# EAGLE board STM32-PROX (EAGLE 6.5.0), part 1 of 2
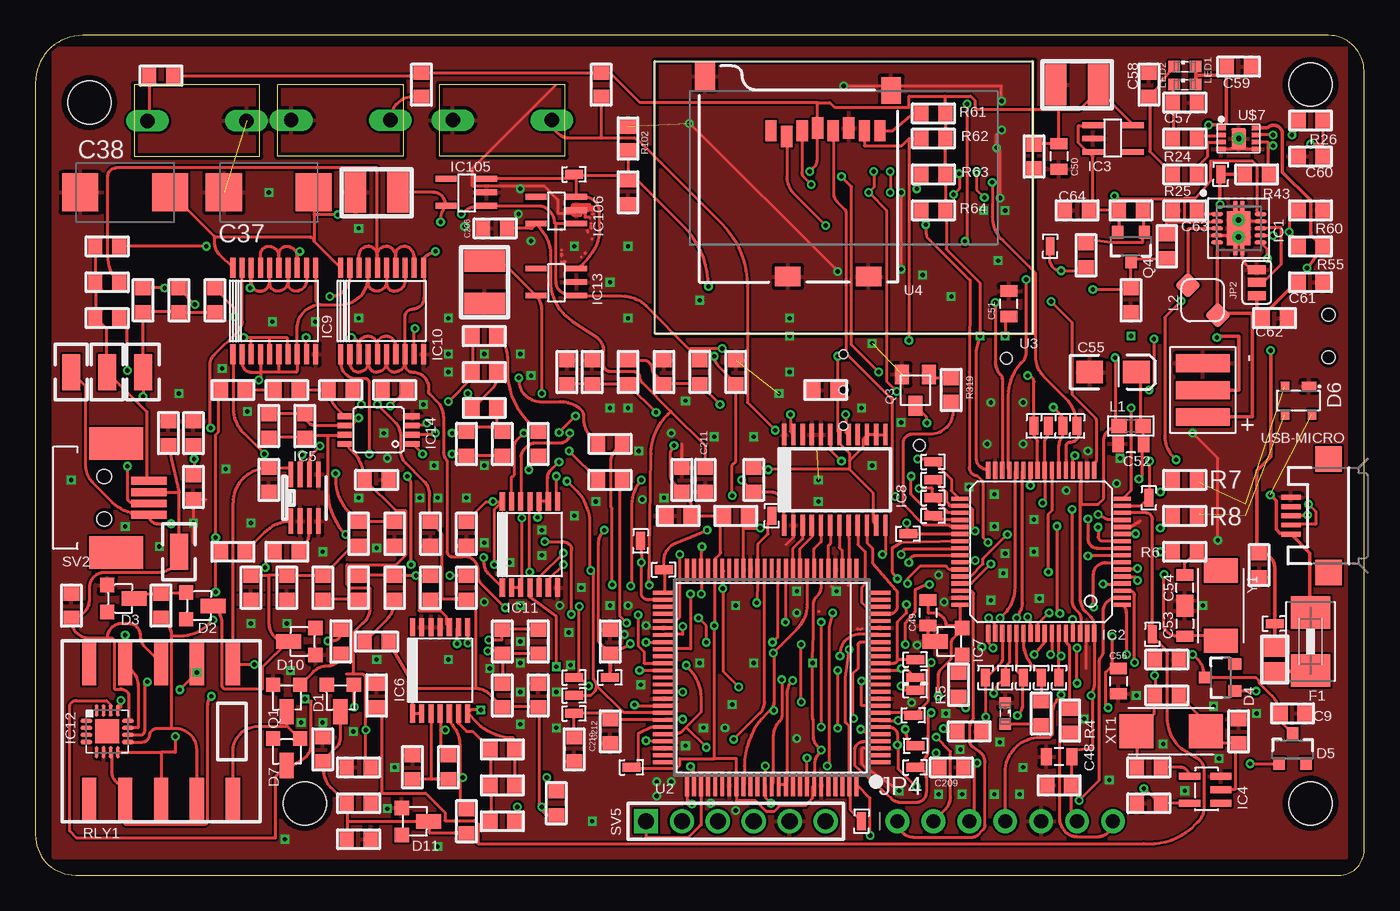
[diagram p8: board, top side]
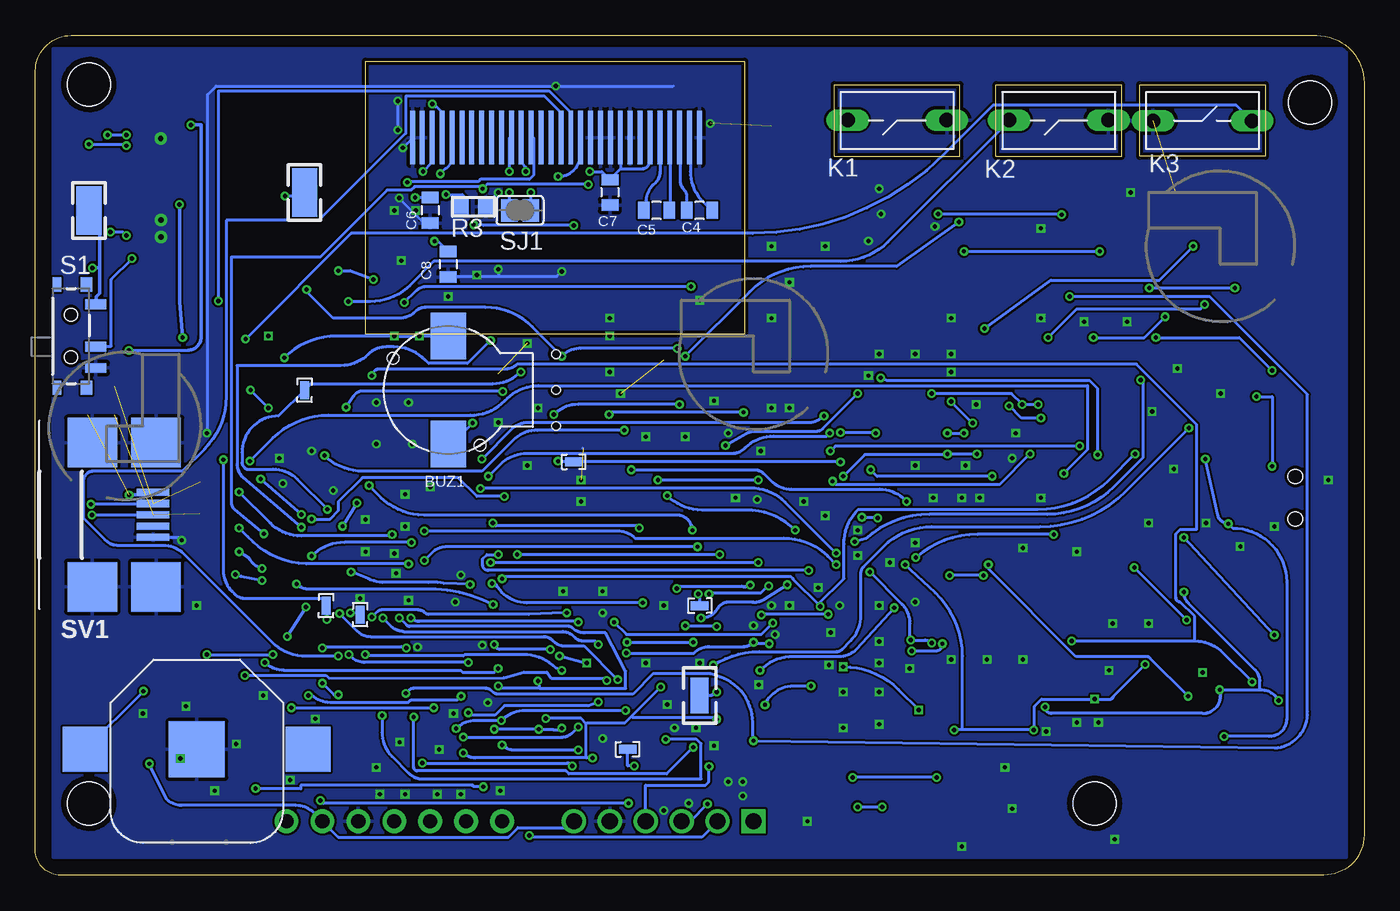
[diagram p9: board, bottom side, seen from below]

Size 93.96 x 59.36 mm. Coordinates in mm from the lower left corner, seen from the top.
Outline: 0,55.99 0,2.84 arc90 2.84,0 92.18,0 arc90 93.96,1.78 93.96,56.82 arc90 91.42,59.36 3.37,59.36 arc90 0,55.99
Outline: 6.98,55.88 6.98,50.8 15.88,50.8 15.88,55.88 6.98,55.88
Outline: 17.14,50.8 17.14,55.88 26.03,55.88 26.03,50.8 17.14,50.8
Outline: 37.46,55.88 28.58,55.88 28.58,50.8 37.46,50.8 37.46,55.88
Outline: 70.61,57.53 43.82,57.53 43.82,38.23 70.61,38.23 70.61,57.53
Copper layers (1*16): Top 0.035mm / dielectric 1.5mm / Bottom 0.035mm
Design rules "ITEADstudio_DRC *": minimum track width 6mil, minimum drill 12mil, track to track 6mil, track to pad 6mil, pad to pad 6mil, via to via 6mil, smd to smd 0mil, copper to edge 10mil, drill to drill 10mil, minimum pad ring 10mil, minimum via ring 6mil, stop-mask expansion 2mil, vias tented up to drill 100mil, thermal gap 10mil
Net classes: 0 default: width 0.203 mm; 1 adc: width 0.203 mm; 2 power: width 0.254 mm, drill 0.254 mm, clearance 0.203 mm
Holes 0.6 mm at 57.15,36.83 57.15,34.29 57.15,31.75

## Footprints (pad centres in the part's own frame; a part is rotated, then mirrored left to right if it is on the bottom)
NSL_SPARKFUN_BATTCON_12MM = smd 3.962 x 3.962: GND 0,0 | smd 3.175 x 3.175: PWR@1 -7.874,0; PWR@2 7.874,0
BUZZER = smd 3.3 x 2.5: 1 3.81,0; 2 -3.81,0 | hole 0.8: -3.897,-2.25; 2.25,3.897
RLC_0603 = smd 1 x 1.1: 1 -0.85,0; 2 0.85,0
0805 = smd 0.8 x 1.2: 1 -0.9,0; 2 0.9,0
RLC_1210 = smd 1.5 x 2.9: 1 -1.5,0; 2 1.5,0
D/7343-31R = smd 2.55 x 2.7: + 3.175,0; - -3.175,0
EIA3216-KIT = smd 1.9 x 1.6: A 1.65,0; C -1.65,0
SOT23-3LEAD = smd 1.016 x 1.016: 1 -0.94,-0.762; 2 0.965,-0.762 | smd 1.016 x 1.778: 3 0.013,1.143
SOT23-3 = smd 0.8 x 0.9: 1 -0.95,-1; 2 0.95,-1; 3 0,1.1
USBUG_SOT143B = smd 1 x 0.7: 1 -0.75,-1 | smd 0.6 x 0.7: 2 0.95,-1; 3 0.95,1; 4 -0.95,1
1812 = smd 2.286 x 2.794: 1 -2.046,0; 2 2.046,0
QFN-10 = smd 0.28 x 0.85: 1 -1,-1.545; 2 -0.5,-1.545; 3 0,-1.545; 4 0.5,-1.545; 5 1,-1.545; 6 1,1.545; 7 0.5,1.545; 8 0,1.545; 9 -0.5,1.545; 10 -1,1.545 | smd 2.4 x 1.65: P0 0,0 | smd 0.7 x 0.28: P1 -1.55,-0.25; P2 1.55,-0.25; P3 1.55,0.25; P4 -1.55,0.25 | drill 0.381: V0 -0.6,0; V1 0.6,0
LQFP64A_PACKAGE = smd 1.2 x 0.3: 1 -5.75,3.75; 2 -5.75,3.25; 3 -5.75,2.75; 4 -5.75,2.25; 5 -5.75,1.75; 6 -5.75,1.25; 7 -5.75,0.75; 8 -5.75,0.25; 9 -5.75,-0.25; 10 -5.75,-0.75; 11 -5.75,-1.25; 12 -5.75,-1.75; 13 -5.75,-2.25; 14 -5.75,-2.75; 15 -5.75,-3.25; 16 -5.75,-3.75; 33 5.75,-3.75; 34 5.75,-3.25; 35 5.75,-2.75; 36 5.75,-2.25; 37 5.75,-1.75; 38 5.75,-1.25; 39 5.75,-0.75; 40 5.75,-0.25; 41 5.75,0.25; 42 5.75,0.75; 43 5.75,1.25; 44 5.75,1.75; 45 5.75,2.25; 46 5.75,2.75; 47 5.75,3.25; 48 5.75,3.75 | smd 0.3 x 1.2: 17 -3.75,-5.75; 18 -3.25,-5.75; 19 -2.75,-5.75; 20 -2.25,-5.75; 21 -1.75,-5.75; 22 -1.25,-5.75; 23 -0.75,-5.75; 24 -0.25,-5.75; 25 0.25,-5.75; 26 0.75,-5.75; 27 1.25,-5.75; 28 1.75,-5.75; 29 2.25,-5.75; 30 2.75,-5.75; 31 3.25,-5.75; 32 3.75,-5.75; 49 3.75,5.75; 50 3.25,5.75; 51 2.75,5.75; 52 2.25,5.75; 53 1.75,5.75; 54 1.25,5.75; 55 0.75,5.75; 56 0.25,5.75; 57 -0.25,5.75; 58 -0.75,5.75; 59 -1.25,5.75; 60 -1.75,5.75; 61 -2.25,5.75; 62 -2.75,5.75; 63 -3.25,5.75; 64 -3.75,5.75
SOT-23-5 = smd 0.4 x 1.5: 1 -0.94,-1.422; 2 0.01,-1.422; 3 0.96,-1.422; 4 0.96,1.428; 5 -0.94,1.428
SMV-5 = smd 1.5 x 0.5: 1 0,0; 2 0,-0.95; 3 0,-1.9; 4 2.2,-1.9; 5 2.2,0
SOT-23-8-OR-MSOP-8 = smd 0.325 x 1.8: 1 -0.975,-1.65; 2 -0.325,-1.65; 3 0.325,-1.65; 4 0.975,-1.65; 5 0.975,1.65; 6 0.325,1.65; 7 -0.325,1.65; 8 -0.975,1.65
TSSOP-14 = smd 1.3 x 0.36: 1 0,0; 2 0,-0.65; 3 0,-1.3; 4 0,-1.95; 5 0,-2.6; 6 0,-3.25; 7 0,-3.9; 8 6.095,-3.9; 9 6.095,-3.25; 10 6.095,-2.6; 11 6.095,-1.95; 12 6.095,-1.3; 13 6.095,-0.65; 14 6.095,0
TSSOP-24 = smd 0.3 x 1.5: 1 -2.925,-3.2; 2 -2.275,-3.2; 3 -1.625,-3.2; 4 -0.975,-3.2; 5 -0.325,-3.2; 6 0.325,-3.2; 7 0.975,-3.2; 8 1.625,-3.2; 9 2.275,-3.2; 10 2.925,-3.2; 11 3.575,-3.2; 12 4.225,-3.2; 13 4.225,3.2; 14 3.575,3.2; 15 2.925,3.2; 16 2.275,3.2; 17 1.625,3.2; 18 0.975,3.2; 19 0.325,3.2; 20 -0.325,3.2; 21 -0.975,3.2; 22 -1.625,3.2; 23 -2.275,3.2; 24 -2.925,3.2
TSSOP-20 = smd 1.4 x 0.36: 1 0,0; 2 0,-0.65; 3 0,-1.3; 4 0,-1.95; 5 0,-2.6; 6 0,-3.25; 7 0,-3.9; 8 0,-4.55; 9 0,-5.2; 10 0,-5.85; 11 6.095,-5.85; 12 6.095,-5.2; 13 6.095,-4.55; 14 6.095,-3.9; 15 6.095,-3.25; 16 6.095,-2.6; 17 6.095,-1.95; 18 6.095,-1.3; 19 6.095,-0.65; 20 6.095,0
QFN16 = smd 0.85 x 0.3: 1 -1.475,0.75; 2 -1.475,0.25; 3 -1.475,-0.25; 4 -1.475,-0.75; 9 1.475,-0.75; 10 1.475,-0.25; 11 1.475,0.25; 12 1.475,0.75 | smd 0.3 x 0.85: 5 -0.75,-1.475; 6 -0.25,-1.475; 7 0.25,-1.475; 8 0.75,-1.475; 13 0.75,1.475; 14 0.25,1.475; 15 -0.25,1.475; 16 -0.75,1.475 | smd 1.7 x 1.7: TH 0,0
MSOP8 = smd 0.41 x 1.02: 1 0,0; 2 0.65,0; 3 1.3,0; 4 1.95,0; 5 1.95,4.8; 6 1.3,4.8; 7 0.65,4.8; 8 0,4.8
SJ_3 = smd 0.635 x 1.27: 1 -0.889,0; 2 0,0; 3 0.965,0
1X07_ROUND = drill 1 pad 1.676: 1 -7.62,0; 2 -5.08,0; 3 -2.54,0; 4 0,0; 5 2.54,0; 6 5.08,0; 7 7.62,0
B3F-5XX = drill 1.016 long: 1 -3.501,-0.029; 2 3.501,-0.029
0603 = smd 1.1 x 1: 1 -0.85,0; 2 0.85,0
CDRH2D18 = smd 1.3 x 1.3 rotated 225: P$1 -1.061,1.061 | smd 1.3 x 1.3 rotated 315: P$2 1.061,-1.061
LED_SML0603 = smd 0.8 x 0.8: A 0.75,0; C -0.75,0
SOT-23-3 = smd 1 x 1.4: 1 -0.95,-1.1; 2 0.95,-1.1; 3 0,1.1
TQ-SMD-RELAY = smd 1 x 3: 1 -5.08,-4.78; 2 -2.54,-4.78; 3 0,-4.78; 4 2.54,-4.78; 5 5.08,-4.78; 6 5.08,4.78; 7 2.54,4.78; 8 0,4.78; 9 -2.54,4.78; 10 -5.08,4.78
SWITCH-SPST-SMD-A = smd 0.7 x 1.5: 1 -2.25,-1.75; 2 -0.75,-1.75; 3 2.25,-1.75 | smd 1 x 0.6: GND1 -3.65,1; GND3 3.65,1 | smd 1 x 0.8: GND2 -3.65,-1.1; GND4 3.65,-1.1 | hole 0.9: -1.5,0; 1.5,0
SOLDERJUMPER_REFLOW = smd 1.168 x 1.6: 1 -0.762,0; 2 0.762,0
USB-MINIB-SMD = smd 2.3 x 0.5: 1 2,0.4; 2 2,-0.4; 3 2,-1.2; 4 2,-2; 5 2,-2.8 | smd 3.5 x 3.5: TAB0 -2.3,3.9; TAB1 2.2,3.9; TAB2 2.2,-6.3; TAB3 -2.3,-6.3
HIROSE-MQ172-4POS = smd 0.55 x 2.5: 1 -1.2,6.75; 2 -0.4,6.75; 3 0.4,6.75; 4 1.2,6.75 | smd 2.3 x 3.8: P$1 -3.85,4.45; P$2 3.85,4.45 | hole 1: -1.5,3.6; 1.5,3.6
HEADER-MALE-6X1-0.100-UNKEYED = drill 1.143 square: 1 0,6.35 | drill 1.143: 2 0,3.81; 3 0,1.27; 4 0,-1.27; 5 0,-3.81; 6 0,-6.35
SMD-TESTPOINT = smd 1.27 x 0.635: 1 0,0
KEYSTONE-SMD-TESTPOINT-5015 = smd 2.54 x 1.27: 1 0,0
--MERGED_KEYSTONE-SMD-TESTPOINT-5015 = smd 3.429 x 1.778: 1 0,0
RLC_0805 = smd 1.3 x 1.5: 1 -0.85,0; 2 0.85,0
VQ100 = smd 0.27 x 1.6: 1 -6,-7.6; 2 -5.5,-7.6; 3 -5,-7.6; 4 -4.5,-7.6; 5 -4,-7.6; 6 -3.5,-7.6; 7 -3,-7.6; 8 -2.5,-7.6; 9 -2,-7.6; 10 -1.5,-7.6; 11 -1,-7.6; 12 -0.5,-7.6; 13 0,-7.6; 14 0.5,-7.6; 15 1,-7.6; 16 1.5,-7.6; 17 2,-7.6; 18 2.5,-7.6; 19 3,-7.6; 20 3.5,-7.6; 21 4,-7.6; 22 4.5,-7.6; 23 5,-7.6; 24 5.5,-7.6; 25 6,-7.6; 51 6,7.6; 52 5.5,7.6; 53 5,7.6; 54 4.5,7.6; 55 4,7.6; 56 3.5,7.6; 57 3,7.6; 58 2.5,7.6; 59 2,7.6; 60 1.5,7.6; 61 1,7.6; 62 0.5,7.6; 63 0,7.6; 64 -0.5,7.6; 65 -1,7.6; 66 -1.5,7.6; 67 -2,7.6; 68 -2.5,7.6; 69 -3,7.6; 70 -3.5,7.6; 71 -4,7.6; 72 -4.5,7.6; 73 -5,7.6; 74 -5.5,7.6; 75 -6,7.6 | smd 1.6 x 0.27: 26 7.6,-6; 27 7.6,-5.5; 28 7.6,-5; 29 7.6,-4.5; 30 7.6,-4; 31 7.6,-3.5; 32 7.6,-3; 33 7.6,-2.5; 34 7.6,-2; 35 7.6,-1.5; 36 7.6,-1; 37 7.6,-0.5; 38 7.6,0; 39 7.6,0.5; 40 7.6,1; 41 7.6,1.5; 42 7.6,2; 43 7.6,2.5; 44 7.6,3; 45 7.6,3.5; 46 7.6,4; 47 7.6,4.5; 48 7.6,5; 49 7.6,5.5; 50 7.6,6; 76 -7.6,6; 77 -7.6,5.5; 78 -7.6,5; 79 -7.6,4.5; 80 -7.6,4; 81 -7.6,3.5; 82 -7.6,3; 83 -7.6,2.5; 84 -7.6,2; 85 -7.6,1.5; 86 -7.6,1; 87 -7.6,0.5; 88 -7.6,0; 89 -7.6,-0.5; 90 -7.6,-1; 91 -7.6,-1.5; 92 -7.6,-2; 93 -7.6,-2.5; 94 -7.6,-3; 95 -7.6,-3.5; 96 -7.6,-4; 97 -7.6,-4.5; 98 -7.6,-5; 99 -7.6,-5.5; 100 -7.6,-6
MICROBUILDER_UG-2864HSWEG01_0.96IN_WRAPAROUND = smd 0.35 x 3.81 bottom: 1 -10.15,8.96; 2 -9.45,8.96; 3 -8.75,8.96; 4 -8.05,8.96; 5 -7.35,8.96; 6 -6.65,8.96; 7 -5.95,8.96; 8 -5.25,8.96; 9 -4.55,8.96; 10 -3.85,8.96; 11 -3.15,8.96; 12 -2.45,8.96; 13 -1.75,8.96; 14 -1.05,8.96; 15 -0.35,8.96; 16 0.35,8.96; 17 1.05,8.96; 18 1.75,8.96; 19 2.45,8.96; 20 3.15,8.96; 21 3.85,8.96; 22 4.55,8.96; 23 5.25,8.96; 24 5.95,8.96; 25 6.65,8.96; 26 7.35,8.96; 27 8.05,8.96; 28 8.75,8.96; 29 9.45,8.96; 30 10.15,8.96
MICRO-SD-SOCKET-PP = smd 0.8 x 1.5: 1 -8.94,10.7; 2 -7.84,10.3; 3 -6.74,10.7; 4 -5.64,10.9; 5 -4.54,10.7; 6 -3.44,10.9; 7 -2.34,10.7; 8 -1.24,10.7 | smd 1.8 x 1.4: CD1 -2.05,0.4; CD2 -7.75,0.4 | smd 1.4 x 1.9: GND1 -13.6,14.55; GND3 -0.45,13.55
STAND-OFF-TIGHT = hole 3.048: 0,0
UDFN-EP = smd 0.3 x 0.65: 1 -0.75,-1.25; 2 -0.25,-1.25; 3 0.25,-1.25; 4 0.75,-1.25; 5 0.75,1.25; 6 0.25,1.25; 7 -0.25,1.25; 8 -0.75,1.25 | smd 1.45 x 1.05: 9 0,0 | drill 0.356: V1 0,0
BATT = smd 1.27 x 3.81: 1 -1.905,0; 2 0,0; 3 1.905,0
USB-MICROB = smd 0.35 x 1.4: D+ 0,2.65; D- -0.65,2.65; GND 1.3,2.65; ID 0.65,2.65; VBUS -1.3,2.65 | smd 1.8 x 1.9: MT1 -4,0; MT2 4,0
XTAL-SMD-CITIZEN-CS10 = smd 2.4 x 2.4: A -0.2,0; B 4.7,0
CRYSTAL-TXC-7A = smd 1.7 x 2.4: P$1 2.485,0; P$2 -2.485,0

## Placement (x,y rotation side)
BAT1  3V  [NSL_SPARKFUN_BATTCON_12MM]  82.55,8.89 0 bottom
BUZ1  BUZZER  [BUZZER]  64.77,34.29 90 bottom
C1  33nF  [RLC_0603]  86.53,21.91 270 top
C2  22pF  [RLC_0603]  85.09,10.16 90 top
C3  22pF  [RLC_0603]  80.01,15.24 0 top
C4  1uF  [0805]  46.99,46.99 180 bottom
C5  1uF  [0805]  50.04,46.99 180 bottom
C6  4.7uF  [0805]  66.04,46.99 270 bottom
C7  4.7uF  [0805]  53.34,48.26 270 bottom
C8  4.7uF  [0805]  64.77,43.18 270 bottom
C9  100nF  [RLC_0603]  88.9,11.43 180 top
C10  100nF  [RLC_0603]  35.56,12.7 90 top
C11  1nF  [RLC_0603]  22.86,2.54 0 top
C12  1nF  [RLC_0603]  30.48,3.81 90 top
C13  dnp  [RLC_0603]  33.02,6.35 0 top
C14  22pF  [RLC_0603]  8.89,19.05 90 top
C15  130pF  [RLC_0603]  15.24,20.32 270 top
C16  1nF  [RLC_0603]  22.86,20.32 90 top
C17  dnp  [RLC_0603]  35.56,16.51 90 top
C18  33nF  [RLC_0603]  39.37,35.56 90 top
C19  33nF  [RLC_0603]  44.45,35.56 90 top
C20  dnp  [RLC_0603]  9.4,31.24 90 top
C21  33nF  [RLC_0603]  22.86,7.62 180 top
C22  33nF  [RLC_0603]  24.13,27.94 0 top
C23  33nF  [RLC_0603]  16.51,27.94 270 top
C24  33nF  [RLC_0603]  30.48,24.13 270 top
C25  33nF  [RLC_0603]  72.39,6.35 180 top
C26  33nF  [RLC_0603]  70.61,50.8 270 top
C27  4.7uF  [RLC_1210]  73.66,55.88 180 top
C28  33nF  [RLC_0603]  45.47,25.4 180 top
C29  33nF  [RLC_0603]  40.64,16.51 90 top
C30  33nF  [RLC_0603]  66.04,10.16 0 top
C31  33nF  [RLC_0603]  49.53,35.56 90 top
C32  33nF  [RLC_0603]  45.72,27.94 90 top
C33  4.7uF  [RLC_1210]  24.13,48.26 180 top
C34  4.7uF  [RLC_1210]  31.75,41.91 270 top
C35  47pF  [RLC_0603]  11.18,31.24 90 top
C36  dnp  [RLC_0603]  11.18,27.43 270 top
C37  100uF  [D/7343-31R]  16.51,48.26 0 top
C38  100uF  [D/7343-31R]  6.35,48.26 0 top
C39  1nF  [RLC_0603]  2.54,19.05 90 top
C40  dnp  [RLC_0603]  33.02,30.48 270 top
C41  dnp  [RLC_0603]  19.05,31.75 270 top
C42  1nF  [RLC_0603]  35.56,30.48 90 top
C43  1nF  [RLC_0603]  13.97,34.29 0 top
C44  33nF  [RLC_0603]  55.88,34.29 180 top
C45  100nF  [RLC_0603]  27.94,24.13 270 top
C46  33nF  [RLC_0603]  77.47,40.64 270 top
C47  33nF  [RLC_0603]  78.74,5.08 180 top
C48  100nF  [0805]  72.39,8.38 180 top
C49  100nF  [0805]  63.12,18.54 270 top
C50  100nF  [0805]  72.39,50.8 270 top
C51  100nF  [0805]  68.83,40.39 90 top
C52  100nF  [0805]  77.47,30.48 180 top
C53  12pF  [0805]  81.28,17.78 270 top
C54  12pF  [0805]  81.28,20.32 90 top
C55  10uF  [EIA3216-KIT]  76.2,35.56 0 top
C56  100nF  [0805]  76.58,13.72 270 top
C57  100nF  [RLC_0603]  81.28,54.61 0 top
C58  100nF  [RLC_0603]  78.74,55.88 90 top
C59  1uF  [RLC_0603]  85.09,57.15 0 top
C60  100nF  [RLC_0603]  90.17,50.8 180 top
C61  1uF  [RLC_0603]  90.17,41.91 0 top
C62  10uF  [RLC_0603]  87.63,39.37 0 top
C63  100nF  [RLC_0603]  81.28,46.99 180 top
C64  10uF  [RLC_0603]  73.66,46.99 180 top
C206  4.7uF  [RLC_0603]  32.51,45.72 180 top
C209  100nF  [RLC_0603]  64.77,7.62 0 top
C210  100nF  [RLC_0603]  38.1,8.89 270 top
C211  100nF  [RLC_0603]  47.37,27.94 270 top
C212  100nF  [RLC_0603]  40.64,10.16 270 top
D1  DIODE-SMD-SOT23  [SOT23-3LEAD]  21.59,12.7 180 top
D2  DIODE-SMD-SOT23  [SOT23-3LEAD]  11.43,19.05 270 top
D3  DIODE-SMD-SOT23  [SOT23-3LEAD]  5.84,19.56 270 top
D4  PMEG4005ET  [SOT23-3]  83.82,13.97 90 top
D5  PMEG4005ET  [SOT23-3]  88.9,8.89 0 top
D6  USBUG_PRTR5V0U2X  [USBUG_SOT143B]  89.31,33.54 180 top
D7  DIODE-SMD-SOT23  [SOT23-3LEAD]  17.78,8.89 180 top
D10  DIODE-SMD-SOT23  [SOT23-3LEAD]  19.05,16.51 90 top
D11  DIODE-SMD-SOT23  [SOT23-3LEAD]  26.67,3.81 270 top
F1  [1812]  90.17,16.51 90 top
IC1  [QFN-10]  85.09,45.72 270 top
IC2  STM32F103RET6  [LQFP64A_PACKAGE]  71.12,22.86 180 top
IC3  PQ1X331M2ZP-3V3-LDO-SOT-23-5  [SOT-23-5]  76.2,52.07 270 top
IC4  HCU-INVERTER  [SMV-5]  83.82,5.08 180 top
IC5  TLV3502  [SOT-23-8-OR-MSOP-8]  19.05,26.67 0 top
IC6  MCP6294  [TSSOP-14]  26.67,11.43 90 top
IC7  MCP100  [SOT23-3LEAD]  64.77,16.51 90 top
IC8  TLC5540  [TSSOP-24]  55.88,27.94 0 top
IC9  74XX244  [TSSOP-20]  13.97,36.83 90 top
IC10  74XX244  [TSSOP-20]  21.59,36.83 90 top
IC11  CD4066  [TSSOP-14]  33.02,20.32 90 top
IC12  NLAST44599MNG  [QFN16]  5.08,10.16 0 top
IC13  PQ1X331M2ZP-3V3-LDO-SOT-23-5  [SOT-23-5]  36.83,41.91 90 top
IC14  AD8052  [MSOP8]  26.67,30.48 90 top
IC105  MCP1824T-250  [SOT-23-5]  30.48,48.26 90 top
IC106  MCP1824T-120  [SOT-23-5]  36.83,46.99 90 top
JP2  JUMPER-3SMD  [SJ_3]  86.36,41.91 270 top
JP4  [1X07_ROUND]  68.58,3.81 0 top
K1  [B3F-5XX]  33.02,53.34 180 bottom
K2  [B3F-5XX]  21.59,53.34 180 bottom
K3  [B3F-5XX]  11.43,53.34 0 bottom
L1  [0603]  77.47,31.75 0 top
L2  CDRH2D18/HPNP-2R2NC  [CDRH2D18]  82.55,40.64 180 top
LED1  [LED_SML0603]  81.28,57.15 0 top
LED2  [LED_SML0603]  81.28,55.88 0 top
LED3  [LED_SML0603]  68.58,11.43 270 top
Q1  NPN-SOT23-2N3904  [SOT23-3LEAD]  17.78,12.7 180 top
Q3  MMBT2222  [SOT-23-3]  62.23,34.29 180 top
Q4  MOSFET-PCHANNELSMD  [SOT23-3]  77.47,44.45 180 top
R1  1M  [RLC_0603]  80.01,12.7 180 top
R2  100  [RLC_0603]  78.74,7.62 180 top
R3  820K  [RLC_0603]  62.99,47.24 180 bottom
R4  10K  [RLC_0603]  73.15,10.92 90 top
R5  10K  [RLC_0603]  65.28,13.46 270 top
R6  390  [RLC_0603]  81.28,22.86 180 top
R7  27  [RLC_0603]  81.28,27.94 180 top
R8  27  [RLC_0603]  81.28,25.4 180 top
R9  100K  [RLC_0603]  29.21,7.62 90 top
R10  100K  [RLC_0603]  26.67,7.62 270 top
R11  510K  [RLC_0603]  20.32,8.89 270 top
R12  100K  [RLC_0603]  36.83,5.08 90 top
R13  10K  [RLC_0603]  33.02,3.81 180 top
R14  10K  [RLC_0603]  33.02,8.89 0 top
R15  10K  [RLC_0603]  17.78,20.32 90 top
R16  zeroohm  [RLC_0603]  20.32,20.32 270 top
R17  10K  [RLC_0603]  27.94,20.32 90 top
R18  10K  [RLC_0603]  33.02,16.51 90 top
R19  10K  [RLC_0603]  33.02,12.7 90 top
R20  240K  [RLC_0603]  13.97,22.86 0 top
R21  24K  [RLC_0603]  17.78,22.86 0 top
R22  33  [RLC_0603]  5.08,39.37 180 top
R23  1K  [RLC_0603]  41.91,48.26 90 top
R24  1K  [RLC_0603]  81.28,52.07 0 top
R25  1K  [RLC_0603]  81.28,49.53 0 top
R26  215.9K  [RLC_0603]  90.17,53.34 0 top
R27  33  [RLC_0603]  7.62,40.64 270 top
R28  33  [RLC_0603]  5.08,41.91 180 top
R29  33  [RLC_0603]  10.16,40.64 270 top
R30  10M  [RLC_0603]  22.86,5.08 0 top
R31  240K  [RLC_0603]  24.13,12.7 270 top
R32  zeroohm  [RLC_0603]  17.78,34.29 0 top
R33  2.4K  [RLC_0603]  30.48,30.48 270 top
R34  10K  [RLC_0603]  16.51,31.75 270 top
R35  zeroohm  [RLC_0603]  31.75,38.1 180 top
R36  dnp  [RLC_0603]  30.48,20.32 90 top
R37  dnp  [RLC_0603]  25.4,20.32 90 top
R38  dnp  [RLC_0603]  24.13,16.51 180 top
R39  1K  [RLC_0603]  40.64,30.48 0 top
R40  10K  [RLC_0603]  21.59,16.51 270 top
R41  10M  [RLC_0603]  22.86,24.13 90 top
R42  1M  [RLC_0603]  25.4,24.13 90 top
R43  74.74K  [RLC_0603]  86.36,49.53 0 top
R44  1K  [RLC_0603]  40.64,27.94 0 top
R45  10K  [RLC_0603]  12.7,40.64 270 top
R46  10K  [RLC_0603]  5.08,44.45 180 top
R47  10K  [RLC_0603]  50.8,27.94 270 top
R48  dnp  [RLC_0603]  21.59,34.29 180 top
R49  2.4K  [RLC_0603]  31.75,35.56 180 top
R50  10K  [RLC_0603]  25.4,34.29 0 top
R51  2.4K  [RLC_0603]  31.75,33.02 0 top
R52  100  [RLC_0603]  46.99,35.56 90 top
R53  330  [RLC_0603]  41.91,35.56 90 top
R54  100  [RLC_0603]  37.59,35.56 270 top
R55  1.5M  [RLC_0603]  90.17,44.45 0 top
R56  10K  [RLC_0603]  77.47,46.99 180 top
R57  10K  [RLC_0603]  74.29,43.81 90 top
R58  dnp  [RLC_0603]  80.01,44.45 90 top
R59  3.3K  [RLC_0603]  49.53,25.4 180 top
R60  150K 1%  [RLC_0603]  90.17,46.99 180 top
R61  10K  [RLC_0603]  63.5,53.85 0 top
R62  10K  [RLC_0603]  63.5,52.07 0 top
R63  10K  [RLC_0603]  63.5,49.53 0 top
R64  10K  [RLC_0603]  63.5,46.99 0 top
R65  330  [RLC_0603]  71.12,11.43 270 top
R69  10K  [RLC_0603]  8.89,56.52 0 top
R70  10K  [RLC_0603]  27.3,55.88 90 top
R71  10K  [RLC_0603]  40.01,55.88 90 top
R102  10K  [RLC_0603]  41.91,52.07 90 top
R319  100  [RLC_0603]  64.77,34.29 270 top
RLY1  RELAY-DPDT  [TQ-SMD-RELAY]  8.89,10.16 180 top
S1  [SWITCH-SPST-SMD-A]  91.44,38.1 90 bottom
SJ1  JUMPER  [SOLDERJUMPER_REFLOW]  59.69,46.99 180 bottom
SV1  USB-MINIB  [USB-MINIB-SMD]  87.63,26.67 0 bottom
SV2  HIROSE-MQ172-4POS  [HIROSE-MQ172-4POS]  1.27,26.67 270 top
SV5  HEADER-MALE-6X1  [HEADER-MALE-6X1-0.100-UNKEYED]  49.53,3.81 90 top
TP1  TESTPAD  [SMD-TESTPOINT]  55.88,29.21 180 bottom
TP2  TESTPADKEYSTONE-SMD  [KEYSTONE-SMD-TESTPOINT-5015]  10.16,22.86 270 top
TP3  TESTPADKEYSTONE-SMD  [KEYSTONE-SMD-TESTPOINT-5015]  2.54,35.56 90 top
TP4  TESTPADKEYSTONE-SMD  [KEYSTONE-SMD-TESTPOINT-5015]  7.62,35.56 270 top
TP5  TESTPADKEYSTONE-SMD  [KEYSTONE-SMD-TESTPOINT-5015]  5.08,35.56 90 top
TP7  TESTPADKEYSTONE-SMD  [KEYSTONE-SMD-TESTPOINT-5015]  46.99,12.7 270 bottom
TP8  TESTPADKEYSTONE-SMD  [SMD-TESTPOINT]  87.63,17.78 180 top
TP9  TESTPADKEYSTONE-SMD  [--MERGED_KEYSTONE-SMD-TESTPOINT-5015]  90.17,46.99 90 bottom
TP10  TESTPADKEYSTONE-SMD  [--MERGED_KEYSTONE-SMD-TESTPOINT-5015]  74.93,48.26 90 bottom
TP11  TESTPAD  [SMD-TESTPOINT]  70.99,18.41 270 bottom
TP16  TESTPAD  [SMD-TESTPOINT]  83.82,49.53 90 top
TP18  TESTPAD  [SMD-TESTPOINT]  42.16,7.62 180 top
TP19  TESTPAD  [SMD-TESTPOINT]  40.64,13.97 180 top
TP20  TESTPAD  [SMD-TESTPOINT]  38.1,11.43 180 top
TP22  TESTPAD  [SMD-TESTPOINT]  38.1,49.53 180 top
TP23  TESTPAD  [SMD-TESTPOINT]  71.75,44.45 90 top
TP24  TESTPAD  [SMD-TESTPOINT]  58.42,3.81 270 top
TP25  TESTPAD  [SMD-TESTPOINT]  42.8,23.62 270 top
TP26  TESTPAD  [SMD-TESTPOINT]  46.99,19.05 0 bottom
TP27  TESTPAD  [SMD-TESTPOINT]  52.07,25.4 90 top
TP28  TESTPAD  [SMD-TESTPOINT]  74.93,34.29 270 bottom
TP29  TESTPAD  [SMD-TESTPOINT]  73.41,19.05 270 bottom
TP30  TESTPAD  [SMD-TESTPOINT]  72.39,13.97 90 top
TP31  TESTPAD  [SMD-TESTPOINT]  62.1,11.3 180 top
TP32  TESTPAD  [SMD-TESTPOINT]  62.23,9.14 0 top
TP33  TESTPAD  [SMD-TESTPOINT]  62.23,13.08 180 top
TP34  TESTPAD  [SMD-TESTPOINT]  62.23,7.62 180 top
TP35  TESTPAD  [SMD-TESTPOINT]  44.45,21.59 180 top
TP36  TESTPAD  [SMD-TESTPOINT]  71.12,13.97 90 top
TP37  TESTPAD  [SMD-TESTPOINT]  62.23,15.24 180 top
TP38  TESTPAD  [SMD-TESTPOINT]  62.23,13.97 180 top
TP39  TESTPAD  [SMD-TESTPOINT]  69.85,13.97 90 top
TP40  TESTPAD  [SMD-TESTPOINT]  52.07,8.89 180 bottom
TP41  TESTPAD  [SMD-TESTPOINT]  68.58,13.97 90 top
TP42  TESTPAD  [SMD-TESTPOINT]  67.18,13.97 90 top
TP43  TESTPAD  [SMD-TESTPOINT]  38.1,12.7 180 top
TP44  TESTPAD  [SMD-TESTPOINT]  38.1,13.97 180 top
TP45  TESTPAD  [SMD-TESTPOINT]  61.72,24.13 180 top
TP46  TESTPAD  [SMD-TESTPOINT]  70.61,31.75 270 top
TP47  TESTPAD  [SMD-TESTPOINT]  71.63,31.75 270 top
TP48  TESTPAD  [SMD-TESTPOINT]  63.5,25.4 180 top
TP49  TESTPAD  [SMD-TESTPOINT]  63.5,26.67 180 top
TP50  TESTPAD  [SMD-TESTPOINT]  63.5,27.94 180 top
TP51  TESTPAD  [SMD-TESTPOINT]  63.5,29.21 180 top
TP52  TESTPAD  [SMD-TESTPOINT]  78.99,17.02 270 top
TP53  TESTPAD  [SMD-TESTPOINT]  78.74,26.67 270 top
TP54  TESTPAD  [SMD-TESTPOINT]  73.66,31.75 270 top
TP55  TESTPAD  [SMD-TESTPOINT]  72.64,31.75 270 top
U1  FERRITE0805  [RLC_0805]  87.63,15.24 90 top
U2  XC3S50  [VQ100]  52.07,13.97 90 top
U3  UG-2864HSWEG01  [MICROBUILDER_UG-2864HSWEG01_0.96IN_WRAPAROUND]  57.15,43.18 0 top
U4  SDCARD  [MICRO-SD-SOCKET-PP]  60.96,41.91 0 top
U$1  [STAND-OFF-TIGHT]  19.05,5.08 0 top
U$2  [STAND-OFF-TIGHT]  3.81,54.61 0 top
U$4  [STAND-OFF-TIGHT]  90.17,55.88 0 top
U$6  [STAND-OFF-TIGHT]  90.17,5.08 0 top
U$7  MC34674  [UDFN-EP]  85.09,52.07 270 top
U$9  BATT  [BATT]  82.55,34.29 270 top
U$11  [L1LOGO]  87.63,31.75 0 top
U$12  [L1LOGO]  10.16,44.45 270 top
U$13  [L1LOGO]  43.18,36.83 270 top
USB-MICRO  USB-MICROB  [USB-MICROB]  91.44,25.4 90 top
XT1  XTAL-SMD-CITIZEN-CS10  [XTAL-SMD-CITIZEN-CS10]  82.55,10.16 180 top
Y1  8Mhz  [CRYSTAL-TXC-7A]  83.82,19.05 270 top

## Tracks (layer width: path | path; a pad name or v marks a point on that pad's centre or on a via)
5V  (via drill 0.3)
  Top 0.203: 81.28,46.18 80.01,46.18 R58.2 | 81.28,46.18 83.52,46.18 IC1.2 | 81.28,47.88 82.04,47.88 83.11,49.07 83.11,50.49 86.05,50.49 86.36,50.19 86.36,46.99 86.61,46.74 IC1.10 | 81.28,46.18 81.28,47.88 | Q4.2 76.56,45.47 76.61,45.52 76.61,46.99 R56.2 | R56.2 C64.1 74.78,47.04 74.78,50.8 | 74.78,50.8 IC3.3 | IC3.1 74.78,52.98 73.76,52.98 73.76,51.77 74.73,50.8 74.78,50.8 | R56.2 76.3,47.04 v76.3,48.01 76.35,47.8 81.23,47.8 81.28,47.88
  Bottom 0.203: TP10.1 75.18,48.01 v76.3,48.01
1356_CRYSTAL  (via drill 0.3)
  Top 0.203: R2.2 77.88,7.62 77.88,10.16 XT1.B 77.93,10.21 79.1,11.38 79.1,12.65 R1.2 79.2,12.7 79.2,14.12 | U2.89 52.58,6.4 53.04,6.4 U2.90 53.04,6.5 53.14,6.6 53.14,12.79 arc-45 v53.54,13.77 | 79.2,14.12 79.2,15.24 C3.1 | v79.15,14.12 79.2,14.12
  Bottom 0.203: v53.54,13.77 53.7,13.92 57.48,13.92 57.79,14.35 59.44,14.35 60.83,13.97 73.2,13.92 73.41,14.12 v79.15,14.12
!CS  (via drill 0.3)
  Top 0.203: v73.3,25.86 73.3,19.4 arc45 73.57,18.76 73.78,18.55 arc-45 73.91,18.23 73.91,17.12 IC2.62 | v57,49.38 57.71,48.67 57.71,37.49 v59.64,35.56
  Bottom 0.203: v73.3,25.86 75.44,27.99 arc-45 77.15,28.7 78.99,28.7 arc45 79.08,28.74 79.23,28.89 arc45 79.35,29.17 79.35,29.87 arc90 76.76,32.46 TP28.1 74.47,34.75 61.6,34.75 arc-45 v59.64,35.56 | v57,49.38 arc-90 55.42,50.95 55.42,52.12 U3.13
!RES  (via drill 0.3)
  Top 0.203: v73.35,18.06 73.35,17.12 IC2.61 | v80.67,29.36 80.46,29.57 arc-45 79.86,31.03 79.86,39.42 v81.03,40.59
  Bottom 0.203: v73.35,18.06 73.35,19.3 TP29.1 73.66,19.56 79.09,19.56 arc45 79.88,19.88 80.04,20.05 arc45 80.67,21.56 v80.67,29.36 | v81.03,40.59 81.03,55.42 57.61,55.42 56.13,53.95 56.13,52.17 U3.14
!SD_CS  (via drill 0.3)
  Top 0.203: v55.88,45.92 53.64,48.17 arc-45 53.14,49.37 53.14,52.17 U4.2 | R64.1 62.64,46.99 62.97,46.69 v62.97,45.97 63.02,45.29 63.02,45.14 66.09,42.06 66.04,35.56 66.04,28.8 arc90 66.6,28.24 67,27.84 67,23.88 v67.36,23.52 | v74.42,22.55 74.42,22.61 IC2.8
  Bottom 0.203: v62.97,45.97 62.28,45.92 v55.88,45.92 | v67.36,23.52 72.09,23.52 arc-45 v74.42,22.55
+1V2  (via drill 0.3)
  Top 0.203: 44.96,32.77 47.37,30.35 C211.1 | 44.96,32.77 42.88,34.84 arc-45 42.72,35.23 arc45 42.63,35.45 arc45 42.24,35.61 40.64,35.61 arc-90 40.18,36.07 40.18,37.06 arc56 39.65,38.05 37.95,39.17 arc-56 36.42,42.02 36.42,43.84 arc45 35.6,45.83 35.41,46.02 IC106.5 35.31,46.02 arc-90 35,45.72 | 35,45.72 35.15,45.72 | 35,45.72 C206.1 | 40.64,10.97 C212.1 | C212.1 40.59,11.07 40.59,11.43 TP20.1 C210.1 | 40.79,10.92 C212.1 | v63.7,8.64 63.7,7.82 63.91,7.62 C209.1 | v54.56,8.28 54.56,6.4 U2.93 | 48.67,20.27 48.67,14.38 v49.73,13.31 | 48.67,20.27 48.67,21.49 48.62,21.54 U2.45 | v45.77,11.02 44.55,11.02 U2.69 40.68,10.97 C212.1 | v43.41,20.5 43.54,29.76 arc-51 44.96,32.77 | v48.62,20.27 48.67,20.27 | v57.86,11.07 arc90 57.79,11.12 57.79,14.22 58.17,14.61 58.17,16.26 arc-90 58.37,16.46 59.64,16.46 59.65,16.47 U2.18
  Bottom 0.203: 55.02,8.28 62.84,8.28 arc45 v63.7,8.64 | v54.56,8.28 55.02,8.28 | v57.86,11.07 55.37,11.07 55.02,10.72 | 55.02,8.28 55.02,10.72 | 51.82,11.23 52.27,10.77 54.97,10.77 55.02,10.72 | 51.82,11.23 v49.73,13.31 | v45.77,11.02 45.92,11.18 51.77,11.18 51.82,11.23 | v43.41,20.5 arc45 44.03,20.42 48.46,20.42 v48.62,20.27
+2V5  (via drill 0.3)
  Top 0.203: v48.01,36.68 arc45 48.29,35.98 49.53,34.75 C31.1 | C33.1 28.14,48.26 arc-90 29.01,47.4 IC105.5 arc45 28.65,46.35 v28.65,46.18 | C30.1 64.21,10.16 v64.21,10.36 | v61.01,10.92 59.69,10.92 U2.7 | v43.18,16.46 44.45,16.46 U2.58 | v42.06,16.36 41.96,16.26 40.69,15.7 TP19.1 C29.1 40.59,15.75 39.83,16.51 39.83,23.4 arc-45 v40.23,24.38 | 52.07,11.79 51.65,11.36 arc45 50.14,7.72 50.14,6.45 50.09,6.4 U2.84 | 52.22,15.7 52.22,12.15 arc-45 52.07,11.79 | 52.22,15.7 52.22,15.75 53.83,17.35 arc45 54.56,19.12 54.56,21.54 U2.33 | v52.17,15.7 52.22,15.7 | 52.07,11.79 v52.22,11.63 | 49.48,34.65 C31.1 | v49.28,26.82 49.28,28.96 49.53,29.21 C31.1
  Bottom 0.203: v48.01,36.68 43.43,41.25 arc45 39.15,43.03 33.07,43.03 v28.65,46.18 | v64.21,10.36 arc45 62.86,10.92 v61.01,10.92 61,10.93 arc45 59.31,11.63 v52.22,11.63 | v42.06,16.36 43.08,16.36 v43.18,16.46 arc45 43.92,16.15 46.29,16.15 arc-45 47.4,15.7 v52.17,15.7 | v49.28,26.82 arc-45 46.82,25.81 43.67,25.81 arc45 v40.23,24.38
+3V3-FPGA  (via drill 0.3)
  Top 0.203: C34.1 31.75,43.38 32.97,43.38 35.36,41 IC13.5 35.46,40.89 arc-45 35.81,40.04 v35.81,34.04 | v45.77,17.58 45.77,17.02 44.5,17.02 U2.57 | v45.16,30.38 44.91,29.87 44.91,28.28 arc45 45.15,27.7 45.67,27.18 C32.1 46.06,26.75 arc-62 46.36,25.55 C28.1 R59.2 48.67,25.4 48.46,25.2 48.46,22.85 arc-45 48.4,22.69 48.11,22.4 48.11,21.59 U2.46 48.01,21.49 v48.01,17.63 48.01,8.23 | U2.31 55.58,21.54 55.58,20.41 arc-45 55.3,19.74 arc45 55.02,19.19 55.02,17.02 54.97,15.29 v54.97,14.99 54.97,11.18 arc45 55.02,10.94 55.02,9.88 arc45 55.35,9.06 v55.58,8.84 v55.57,8.84 arc45 55.12,7.74 55.12,6.45 U2.94 55.07,6.35 54.97,6.25 54.97,5.44 54.46,4.93 52.58,4.93 52.58,4.83 52.27,4.52 51.66,4.52 50.9,5.28 49.57,5.28 U2.83 49.57,8.23 48.01,8.23 | U2.19 59.64,17.02 58.17,17.02 arc90 v56.9,15.49 | IC4.5 C47.1 79.5,5.13 v78.38,6.12 | 42.62,7.57 42.62,10.01 43.59,10.46 44.45,10.46 U2.70 | 48.01,8.23 45.57,8.23 45.57,7.77 45.36,7.57 42.62,7.57 | 59.69,10.46 U2.6 60.4,10.47 arc-90 60.96,9.91 v60.96,9.2 60.96,9.14 61.01,9.14 61.01,7.52 v62.28,6.25 | TP18.1 42.57,7.62 42.62,7.57
  Bottom 0.203: v45.77,17.58 45.82,17.63 v48.01,17.63 | v45.16,30.38 43.69,31.22 arc30 43.03,31.39 38.68,31.39 arc-45 38.3,31.55 v35.81,34.04 | v55.58,8.84 60.1,8.84 arc45 v60.96,9.2 | v62.28,6.25 62.99,6.25 62.99,6.35 75.18,6.35 75.18,6.1 v78.38,6.12 | v56.9,15.49 v54.97,14.99
ADC1
  Top 0.203: U2.35 53.57,23.09 54.26,23.77 IC8.3
ADC2
  Top 0.203: IC8.4 54.91,23.92 54.07,23.08 U2.34
ADC3
  Top 0.203: U2.32 55.07,23.07 55.55,23.55 IC8.5
ADC4
  Top 0.203: U2.30 56.07,23.3 56.2,23.44 IC8.6
ADC5
  Top 0.203: U2.28 57.07,22.94 56.86,23.15 IC8.7
ADC6
  Top 0.203: IC8.8 57.51,23.88 57.57,23.81 U2.27
ADC7
  Top 0.203: IC8.9 58.17,24.74 58.17,23.37 58.67,22.86 58.67,20.57 58.42,20.32 58.42,19.3 58.75,18.97 U2.23
ADC8
  Top 0.203: IC8.10 58.8,23.49 59.18,23.11 59.18,22.1 60.83,20.19 arc-45 60.96,19.96 60.96,19.01 arc-45 60.81,18.65 60.79,18.63 arc-45 60.41,18.47 U2.22
ADC_CLK  (via drill 0.3)
  Top 0.203: v45.57,22.66 45.57,18.24 45.31,17.98 44.5,17.98 U2.55 | IC8.12 60.11,22.66 v59.89,22.66
  Bottom 0.203: v45.57,22.66 v59.89,22.66
ADC_IN  (via drill 0.3)
  Top 0.203: v57,29.26 56.24,30.02 56.24,31.09 IC8.19 | IC11.2 IC11.3 34.39,20.37 v34.39,25.25 | v35.51,25.3 35.61,25.4 35.61,26.31 IC11.10 35.66,26.42 36.22,26.42 IC11.9 36.22,26.52 36.22,28.08 arc-45 36.44,28.62 v37.03,29.21
  Bottom 0.203: v57,29.26 55.93,29.26 TP1.1 v37.03,29.21 | v34.39,25.25 34.44,25.3 v35.51,25.3
ADC_NOE  (via drill 0.3)
  Top 0.203: IC8.1 52.93,24.79 52.93,26.12 arc90 51.98,27.08 50.8,27.08 R47.2 50.75,27.13 v49.94,27.94 | v46.33,19.86 46.33,16 44.5,16 U2.59 | v42.11,20.45 42.16,20.75 42.16,25.98 arc-45 v42.85,27.94
  Bottom 0.203: v46.33,19.86 46.13,19.94 42.67,19.94 42.16,20.45 v42.11,20.45 | v49.94,27.94 v42.85,27.94
ADCDR_HI  (via drill 0.3)
  Top 0.203: C17.2 35.56,17.37 33.02,17.37 R18.2 32.97,17.27 32.97,16.61 v32.05,16.61 | v30.58,16.41 30.58,17.48 IC6.8 | v34.95,21.44 34.95,26.36 IC11.11
  Bottom 0.203: v30.58,16.41 arc-45 31.07,16.61 v32.05,16.61 32.11,16.66 32.11,17.79 arc-45 32.67,19.16 v34.95,21.44
ADCDR_LO  (via drill 0.3)
  Top 0.203: 33.93,6.3 C13.2 33.88,6.35 33.88,8.89 R14.2 33.78,8.94 33.78,9.7 arc-45 31.27,10.75 30.58,11.43 IC6.7 30.82,11.68 v31.5,11.68 | IC11.4 34.97,19.64 36.83,18.29 v36.83,14.73
  Bottom 0.203: v36.83,14.73 arc45 32.93,13.12 v31.5,11.68
AMPL_HI  (via drill 0.3)
  Top 0.203: R42.2 25.4,24.99 22.86,24.99 R41.2 22.81,25.04 22.17,25.69 arc-45 21.23,27.94 v21.23,28.4 | v78.79,29.26 78.79,26.72 TP53.1 78.18,26.11 IC2.15
  Bottom 0.203: v21.23,28.4 19.56,30.07 19.56,34.59 58.4,34.59 arc-45 60.6,33.68 60.75,33.53 arc45 63.22,32.51 73.24,32.51 arc-45 77.17,30.89 v78.79,29.26
AMPL_LO
  Top 0.203: IC2.14 76.91,25.6 78.54,25.6 arc-90 78.99,25.15 TP52.1 78.74,17.71 arc45 79.16,16.7 79.9,15.96 arc-45 80.06,15.57 80.06,10.94 arc45 81.05,8.92 82.37,8.11 arc-45 82.65,7.42 82.65,4.64 arc-45 82.17,3.73 81.69,3.26 arc-45 78.36,2.23 31.29,2.23 31.29,3.61 31.04,3.86 28.96,3.86 28.96,4.42 27.58,5.79 24.54,5.79 24.49,5.84 | 24.49,5.84 23.72,5.08 R30.2 | 24.49,5.84 24.49,11.48 24.13,11.84 R31.2
ANT_HI  (via drill 0.3)
  Top 0.203: 8.89,5.59 RLY1.8 8.89,8.68 | 5.84,8.64 IC12.8 8.89,8.68 | v9.6,24.84 8.64,24.84 arc-90 8.03,25.45 SV2.4 7.92,25.5 7.48,25.5 arc-45 5.47,26.33 4.08,27.72 arc-45 3.56,28.99 3.56,34.54 TP3.1 | C35.1 11.18,29.46 arc90 v11.23,29.41 11.23,28.33 arc-90 C36.1 | v9.91,9.8 9.91,8.68 8.89,8.68
  Bottom 0.203: v11.23,29.41 10.34,25.44 arc-77 v9.6,24.84 9.3,24.54 arc90 5.49,20.73 5.49,11.03 arc90 6.71,9.8 v9.91,9.8
ANT_LO
  Top 0.203: IC12.12 6.6,10.92 6.6,12.73 arc45 6.52,12.94 arc45 5.99,13.16 5.59,13.16 5.59,16.51 arc90 5.33,16.76 5.08,16.76 | RLY1.3 8.89,14.99 7.78,16.09 arc-45 7.44,16.91 arc90 6.57,17.78 6.1,17.78 arc90 5.08,16.76 | 10.16,27.03 8.03,27.03 SV2.2 | 10.16,27.03 TP2.1 10.11,22.81 arc-90 8.69,21.39 4.88,21.39 arc90 3.81,20.32 3.81,19.47 arc-90 C39.1 2.54,18.03 arc90 3.81,16.76 5.08,16.76 | C20.1 10.16,27.03
BOOT0
  Top 0.203: IC2.60 72.9,17.07 72.9,16.46 73.02,16.33 arc-45 73.1,16.15 73.1,11.9 R4.2
BOOT0_
  Top 0.203: JP4.7 arc-90 75.08,2.69 73.7,2.69 arc-45 72.85,3.05 arc-45 72.44,4.03 72.44,10.31 73.15,10.31 R4.1
CROSS_HI  (via drill 0.3)
  Top 0.203: v37.74,29.97 39.78,27.94 R44.1 | v20.12,30.33 19.7,29.91 arc45 19.41,29.2 19.41,28.35 IC5.6
  Bottom 0.203: v37.74,29.97 37.39,30.33 v20.12,30.33
CROSS_LO  (via drill 0.3)
  Top 0.203: v34.19,35.15 arc90 35.61,33.48 37.13,33.48 arc-45 38.61,32.87 arc-45 38.76,32.5 38.76,32.28 arc45 39.32,30.94 39.78,30.48 R39.1 | v18.85,29.72 18.74,29.62 18.74,28.35 IC5.7
  Bottom 0.203: v34.19,35.15 33.73,34.95 19.41,34.95 18.85,34.39 v18.85,29.72
D/C  (via drill 0.3)
  Top 0.203: TP30.1 72.39,15.49 | 72.39,15.49 72.39,17.07 IC2.59 | v72.54,15.49 72.39,15.49
  Bottom 0.203: v72.54,15.49 74.82,15.49 arc45 77.26,16.51 83.49,22.73 arc-45 84.9,23.32 88.11,23.32 arc45 89.03,23.7 90.58,25.25 90.58,27.82 arc90 89.84,28.55 83.57,28.55 82,30.12 arc-45 80.47,33.81 80.47,46.28 73.91,46.28 67.77,52.43 67.77,55.07 57.96,55.07 56.84,53.95 56.84,52.17 U3.15
D_N  (via drill 0.3)
  Top 0.203: v79.55,27.08 80.42,27.94 R7.2 | v68.73,24.08 67,22.35 67,22 66.14,21.13 65.38,21.13 IC2.44
  Bottom 0.203: v79.55,27.08 77.37,24.9 arc-45 75.16,23.98 68.83,23.98 v68.73,24.08
D_P  (via drill 0.3)
  Top 0.203: v79.55,24.54 80.42,25.4 R8.2 | v67.56,22 66.19,20.62 65.38,20.62 IC2.45
  Bottom 0.203: v67.56,22 74.8,22 arc45 78.94,23.92 v79.55,24.54
DB2  (via drill 0.3)
  Top 0.203: v60.45,49.73 v60.45,48.26
  Bottom 0.203: v60.45,48.26 SJ1.2 | v60.45,49.73 60.45,52.12 60.35,52.12 U3.20
DBG  (via drill 0.3)
  Top 0.203: v45.77,12.95 44.5,12.95 U2.65
  Bottom 0.203: TP7.1 46.38,12.7 arc-45 v45.77,12.95
FPGA_CCLK  (via drill 0.3)
  Top 0.203: v61.77,22.1 arc-90 62.28,22.61 62.79,22.61 IC2.41 | U2.52 43.38,19.47 arc-90 42.85,19.87 v42.85,22.1 42.93,22.1 TP25.1
  Bottom 0.203: v42.85,22.1 v61.77,22.1
FPGA_DIN  (via drill 0.3)
  Top 0.203: v66.45,22.25 66.45,22.15 65.38,22.15 IC2.42 | v47.14,23.22 47.09,22.4 47.09,21.59 U2.48 47.09,21.49 v47.09,19.86
  Bottom 0.203: v47.14,23.22 64.87,23.22 arc-45 65.91,22.78 v66.45,22.25 | TP26.1 46.99,19.86 v47.09,19.86
FPGA_DONE  (via drill 0.3)
  Top 0.203: v70.36,27.53 70.36,28.6 IC2.26 | v47.5,24.38 45.25,23.45 arc67 44.45,22.25 TP35.1 44.5,21.54 44.5,20.02 U2.51
  Bottom 0.203: v70.36,27.53 69.53,26.71 arc-45 66.49,25.45 48.62,25.45 arc87 v47.5,24.38
FPGA_DOUT/PCK0  (via drill 0.3)
  Top 0.203: v51,19.25 51.05,20.32 51.05,21.54 U2.40 51.11,21.64 51.11,23.42 51.82,24.13 51.82,24.79 arc-45 TP27.1 | IC2.43 65.33,21.59 64.64,21.59 64.39,21.84 62.55,21.84 61.67,20.97 v61.67,20.62
  Bottom 0.203: v51,19.25 59.22,19.25 arc62 61.37,20.54 v61.67,20.62
FPGA_NINIT  (via drill 0.3)
  Top 0.203: IC2.38 65.33,24.13 TP45.1 61.62,24.26 v61.62,24.89 | 50.09,24.54 50.09,21.59 U2.42 | 50.09,24.54 50.09,25.15 50.34,25.4 R59.1 | 50.09,24.54 v51.26,24.54
  Bottom 0.203: v51.26,24.54 51.41,24.69 61.42,24.69 v61.62,24.89
FPGA_NPROGRAM  (via drill 0.3)
  Top 0.203: v71.63,21.44 71.63,25.5 71.78,25.65 71.87,25.74 IC2.23 | v57.56,15.95 57.28,13.97 57.28,10.8 57.56,10.52 57.56,6.4 U2.99 57.61,6.3 57.61,4.62 TP24.1 | v61.52,16.31 61.52,17.83 62.23,18.67 62.23,20.19 62.99,20.57 63.32,20.57 v63.22,20.55
  Bottom 0.203: v71.63,21.44 70.39,20.94 arc-22 69.42,20.7 66.17,20.7 arc19 65.08,20.63 v63.22,20.55 | v57.56,15.95 61.17,15.95 arc45 v61.52,16.31
FPGA_ON  (via drill 0.3)
  Top 0.203: TP22.1 38.25,49.38 IC106.3 38.27,47.93 38.82,47.93 arc-90 39.9,46.85 39.9,45.83 arc-58 IC13.3 | IC105.3 38.2,49.23 TP22.1 | R102.1 R23.2 | v67.87,40.49 67.87,36.29 arc45 68.24,35.39 arc-45 68.38,35.07 68.38,28.65 IC2.30 | 41.96,49.02 R23.2 | TP22.1 38.3,49.43 41.86,49.43 R23.2 | v47.6,41.6 arc45 45.84,45.85 42.67,49.02 42,49.02 R23.2
  Bottom 0.203: v47.6,41.6 66.25,41.6 arc-45 67.1,41.25 v67.87,40.49
FPGA_TCK  (via drill 0.3)
  Top 0.203: 46.48,7.52 v46.33,7.67 46.53,7.67 46.53,6.4 46.58,6.38 U2.77
  Bottom 0.203: SV5.4 50.8,6.35 50.78,6.37 U2.77 46.33,6.61 v46.33,7.67
FPGA_TDI  (via drill 0.3)
  Top 0.203: v59.03,2.79 59.03,5.44 58.12,6.35 U2.100
  Bottom 0.203: v59.03,2.79 58.93,2.69 46.84,2.69 SV5.2
FPGA_TDO  (via drill 0.3)
  Top 0.203: 46.18,5.28 v46.43,5.03 46.08,5.03 46.08,6.35 U2.76
  Bottom 0.203: v46.43,5.03 47.65,3.81 SV5.3
FPGA_TMS
  Top 0.203: SV5.1 43.18,2.69 46.18,2.69 46.99,3.5 arc90 47.07,3.58 U2.78
GND  (via drill 0.3)  (5 unrouted)
  Top 0.203: 85.09,51.31 84.07,51.31 U$7.4 | U$7.V1 85.09,51.31 | 39.37,47.24 39.4,47.18 | 39.4,47.18 39.41,47.17 | 39.12,46.99 39.12,47 | 39.37,46.74 39.5,46.74 | IC106.2 38.61,46.99 38.61,47 | IC106.2 38.86,46.99 38.86,47 | 38.61,43.69 38.6,43.7 | 38.86,43.94 38.9,44.01 38.91,43.99 | 39.37,44.96 39.35,44.96 | 38.35,46.99 IC106.2 | 39.37,46.99 39.41,46.99 | IC8.2 53.59,24.74 53.59,23.88 53.09,23.37 | 65.33,19.66 IC2.47 | 39.01,45.57 39.01,45.55 39.07,45.47 | 39.27,45.77 39.3,45.73 39.27,45.87 | 39.4,47.18 39.42,47.19 39.41,47.17 | 39.32,47.14 39.32,47 | 39.47,47.09 39.41,47 39.42,47.14 | 39.27,47.14 39.27,47 | 37.29,43.28 37.38,43.37 37.34,43.28 | 37.39,43.33 37.39,43.37 | 37.49,43.33 37.49,43.37 | 37.44,43.33 37.44,43.37 | 37.19,43.28 37.24,43.23 | 37.24,43.23 | 37.19,43.79 37.23,43.79 | 39.32,47.19 39.41,47.17 | IC106.2 38.41,46.94 38.41,47 | IC106.2 38.51,46.94 38.51,47 | IC106.2 38.35,46.94 38.35,47 | 37.19,44.2 37.23,44.2 | 36.78,55.83 30.89,49.94 30.89,48.72 35.97,48.72 36.93,47.75 36.93,46.79 37.9,46.79 37.9,47.19 37.95,47.19 37.95,46.74 38,46.74 38,47.4 38.05,47.4 38.1,47.35 38.1,47.19 39.17,47.19 39.22,47.24 39.22,47.4 38.1,47.4 38.05,47.35 38.05,46.63 38.56,46.63 38.56,46.84 38.86,46.84 38.86,46.53 39.12,46.53 39.22,46.46 | v56.74,42.67 46.25,53.16 v46.23,53.14 | v61.21,48.26 v61.21,42.82 | v57.15,55.78 68.33,55.78 v68.33,54.71 | v68.33,52.68 67.97,52.32 v67.97,51.41 68.22,51.16 v68.22,47.85 | v81.84,31.24 83.62,29.46 v83.62,23.67 | U$7.5 86.34,51.31 85.09,51.31 | IC1.9 85.59,46.22 arc90 IC1.P0 arc-90 84.59,45.22 IC1.4 | IC1.P1 84.84,46.57 arc90 IC1.V0 | IC1.P2 84.84,44.87 arc-90 IC1.V1 | IC1.P3 85.34,43.82 arc90 JP2.1
  Top 0.203: 12.06,26.54 C36.2 11.18,23.49 | 39.27,46.08 39.3,46.08 | 37.19,45.62 37.23,45.62 | IC106.2 38.76,46.99 38.76,47 | 37.19,43.33 37.26,43.26 | 37.26,43.2 37.24,43.23 | 37.19,43.89 37.23,43.89 | U2.29 56.54,21.41 56.57,21.41 | 57.48,20.47 | 56.39,20.37 56.28,20.39 56.41,20.37 | 55.4,18.64 55.42,18.64 | 58.14,17.37 58.15,17.42 | 58.32,17.37 58.47,17.42 | C32.2 45.72,30.48 | U2.3 58.5,8.97 58.42,8.89 58.42,7.87 58.67,7.62 v61.09,5.97 | IC2.63 74.37,16.84 74.29,16.76 74.29,14.61 | C49.2 63.12,17.03 IC7.3 | IC2.12 77.44,24.61 78.1,25.02
  Bottom 0.203: v56.74,42.67 57.1,42.32 61.21,42.32 | 61.21,42.32 64.77,42.32 C8.2 | v61.21,42.82 61.21,42.32 | v61.21,48.26 62.13,47.35 62.13,47.24 R3.1 62.15,47.09 | 48.87,55.78 v57.15,55.78 81.18,55.78 81.79,55.17 81.79,31.24 v81.84,31.24 | v68.33,52.68 v68.33,54.71 | v67.97,51.41 67.26,52.12 U3.30 | v68.22,47.85 66.5,46.13 66.04,46.13 C6.2 | 55.25,30.18 55.25,30.2 | BAT1.GND 83.06,8.89 v83.69,8.25 | SV1.5 83.81,23.87 arc90 v83.62,23.67
  other vias: 41.91,44.45 38.1,44.45 40.64,41.91 22.86,45.72 16.51,48.26 34.29,48.51 49.53,19.05 50.8,14.99 46.99,14.99 47.24,10.41 49.28,12.07 34.16,46.74 30.35,45.85 35.05,44.83 56.64,20.07 55.37,26.42 55.37,27.94 8.76,23.24 6.35,24.64 13.46,28.7 15.24,24.89 10.16,34.04 2.54,27.94 11.18,24.89 50.8,30.99 48.01,30.99 59.18,28.96 53.85,20.07 53.85,18.54 69.85,30.48 72.9,27.18 70.61,25.15 67.82,24.64 67.82,26.92 66.04,27.43 68.07,43.43 62.74,42.42 67.06,46.99 68.58,46.99 64.77,40.89 76.45,27.69 76.71,29.46 41.91,39.37 46.99,40.64 53.34,39.37 58.42,33.02 40.64,33.02 38.1,25.4 29.21,39.37 53.34,35.56 41.91,33.02 53.34,38.1 59.18,37.59 52.58,34.04 61.21,32 45.97,33.53 39.62,26.42 15.24,17.78 17.78,17.78 20.32,22.86 18.03,14.48 24.13,15.24 26.67,15.24 29.21,15.24 32.13,14.61 34.29,12.95 34.29,10.67 36.83,10.41 36.83,12.95 37.08,19.05 34.29,19.05 33.53,22.1 30.48,26.67 28.45,26.67 28.19,28.96 22.86,26.67 31.75,28.96 44.45,26.67 42.67,29.97 35.81,24.38 35.81,22.61 38.61,20.32 24.89,29.46 24.64,31.24 14.99,32.77 13.21,35.81 16.76,39.12 19.81,39.12 22.86,39.37 27.43,33.27 29.21,35.56 29.21,36.83 31.75,36.83 34.29,36.83 35.05,35.31 40.64,19.05 37.72,17.14 41.66,17.02 44.96,31.24 24.13,23.11 27.18,26.67 67.31,30.48 45.97,9.14 47.75,5.08 49.53,4.57 44.96,6.6 43.94,6.6 43.94,5.59 48.77,10.41 53.85,9.65 74.42,29.97 69.85,33.4 67.56,33.4 69.85,7.62 68.2,9.4 75.95,6.73 77.85,12.7 67.82,5.71 69.6,5.71 65.53,5.71 63.88,5.71 86.36,11.43 83.31,11.94 79.76,9.27 81.28,5.97 82.55,19.05 39.37,3.81 28.45,2.03 17.65,2.54 24.89,4.7 25.4,7.62 20.32,10.8 22.48,10.16 18.8,10.8 43.18,17.65 41.91,19.05 42.8,13.46 31.75,19.3 67.56,19.43 34.29,16.51 34.29,14.99 31.75,23.49 42.93,26.54 37.85,14.86 63.88,21.21 62.36,16.26 65.41,8.89 64.39,11.43 70.99,19.56 70.61,22.86 68.45,21.34 68.58,22.73 74.17,11.05 64.26,19.3 66.93,16.13 61.98,12.19
  pour Top: 1.27,58.42 1.27,1.27 92.71,1.27 92.71,58.42
  pour Bottom: 92.71,58.42 1.27,58.42 1.27,1.27 92.71,1.27
  pour Bottom (no thermals): 86.36,53.34 86.36,50.8 83.82,50.8 83.82,53.34
  pour Bottom (no thermals): 85.6,47.5 85.6,46.99 85.85,46.99 85.85,44.7 85.6,44.45 85.34,44.45 85.34,43.69 84.84,43.69 84.84,44.45 84.33,44.45 84.33,46.74 84.84,47.24 84.84,47.5
JTAG_TCK  (via drill 0.3)
  Top 0.203: v73.66,13.56 v73.66,16.05 | v72.54,12.75 72.48,12.69 arc45 71.93,11.37 71.93,9.96 71.73,9.75 71.06,9.75 arc90 68.58,7.27 JP4.4 | IC2.49 67.37,16.53 v67.72,16.05
  Bottom 0.203: v67.72,16.05 68.07,16.15 73.56,16.15 v73.66,16.05 | v73.66,13.56 72.85,12.75 v72.54,12.75
JTAG_TDI  (via drill 0.3)
  Top 0.203: v67.41,18.19 67.82,17.78 67.82,17.17 IC2.50 | v55.58,10.46 v55.58,17.88 | v63.7,9.75 64.72,8.74 64.72,5.54 arc-45 64.36,4.67 JP4.2
  Bottom 0.203: v67.41,18.19 arc-45 66.8,17.93 55.63,17.93 v55.58,17.88 | v63.7,9.75 56.77,9.75 arc-45 55.94,10.1 v55.58,10.46
JTAG_TDO  (via drill 0.3)
  Top 0.203: v56.39,18.54 56.13,17.53 56.13,7.87 v55.98,7.72 | v66.6,7.92 66.4,7.72 66.4,4.57 arc-45 66.11,3.88 JP4.3 | IC2.55 70.37,18.02 v70.16,18.24
  Bottom 0.203: v70.16,18.24 69.75,18.64 arc45 69.5,18.74 66.92,18.74 arc45 66.37,18.52 arc-45 66.18,18.44 59.08,18.44 56.57,18.54 v56.39,18.54 | v66.6,7.92 56.37,7.92 arc45 56.05,7.79 v55.98,7.72
JTAG_TMS
  Top 0.203: JP4.1 arc90 62.08,2.69 66.3,2.69 arc45 66.64,2.83 67.02,3.21 arc45 67.16,3.55 67.16,7.97 arc54 66.78,8.71 66.2,9.14 arc-45 66.09,9.39 66.09,10.57 arc-45 66.27,11 66.34,11.07 66.34,19.85 arc90 66.13,20.07 65.38,20.07 IC2.46
JTRST  (via drill 0.3)
  Top 0.203: IC2.56 70.87,17.73 v71.68,18.54
  Bottom 0.203: v71.68,18.54 71.07,18.52 71.12,18.52 TP11.1
LED3
  Top 0.203: R65.2 71.12,10.67 68.58,10.67 LED3.A
LED_A
  Top 0.203: R65.1 TP36.1 71.01,14.33 arc-45 69.87,16.11 IC2.54
MISO  (via drill 0.3)
  Top 0.203: v75.49,20.57 76.86,20.57 IC2.4 | U2.15 59.69,14.99 60.71,14.99 arc90 60.96,15.24 | TP37.1 60.96,15.24 | 60.96,15.24 60.96,17.91 61.59,18.54 v61.59,19.13
  Bottom 0.203: v75.49,20.57 arc-45 74.63,20.22 66.5,20.22 arc29 v61.59,19.13
MOSI  (via drill 0.3)
  Top 0.203: v77.72,15.04 77.72,19.78 arc90 77.44,20.07 76.91,20.07 IC2.3 | TP38.1 61.59,14.61 v61.24,14.61 61.1,14.47 U2.14
  Bottom 0.203: v77.72,15.04 arc-45 76.38,14.48 63.88,14.48 63.75,14.35 61.49,14.35 v61.24,14.61
MUXSEL_HIPKD  (via drill 0.3)
  Top 0.203: IC2.36 65.33,25.15 63.5,25.15 TP48.1 63.45,25.4 61.93,26.92 v61.93,28.19 | v37.8,31.24 arc-90 37.08,30.53 35.33,30.53 arc45 34.77,30.3 34.53,30.06 arc45 34.34,29.6 34.34,26.42 IC11.12
  Bottom 0.203: v37.8,31.24 38,31.04 41.74,31.04 arc-45 43.77,30.2 arc45 44.68,29.82 59.2,29.82 arc-45 61.08,29.04 v61.93,28.19
MUXSEL_HIRAW  (via drill 0.3)
  Top 0.203: TP50.1 63.55,27.94 64.41,27.08 64.41,26.42 64.62,26.21 64.62,26.11 65.33,26.11 IC2.34 65.43,26.06 66.04,26.06 66.24,25.86 66.24,24.54 v66.45,24.33 | v37.34,21.95 36.27,20.88 IC11.6
  Bottom 0.203: v37.34,21.95 37.92,22.53 arc-45 41.05,23.82 51.56,23.82 arc-45 52.79,24.33 v66.45,24.33
MUXSEL_LOPKD  (via drill 0.3)
  Top 0.203: IC2.35 65.33,25.65 64.41,25.65 64.41,25.81 63.55,26.67 TP49.1 63.45,26.72 63.45,27.33 v62.48,27.33 | v37.34,22.76 35.62,21.04 IC11.5 35.66,20.32
  Bottom 0.203: v37.34,22.76 40.94,26.36 arc-45 43.4,27.38 62.43,27.38 v62.48,27.33
MUXSEL_LORAW  (via drill 0.3)
  Top 0.203: IC2.33 65.33,26.62 64.77,27.18 64.77,27.99 63.55,29.21 TP51.1 63.45,29.26 63.45,29.41 v62.38,29.41 | v34.54,31.24 34.01,30.7 arc45 33.88,30.41 33.88,28.3 33.78,28.19 arc90 33.68,28.09 IC11.13 | v38.2,32.46 v37.03,31.29
  Bottom 0.203: v34.54,31.24 34.59,31.29 v37.03,31.29 | v62.38,29.41 60.24,31.56 arc45 59.16,32 39.3,32 arc-45 v38.2,32.46
N$2  (via drill 0.3)
  Top 0.203: Y1.P$1 83.82,16.92 81.28,16.92 C53.2 81.23,16.97 arc-90 79.81,17.5 v79.81,21.26 | IC2.5 76.91,21.08 77.8,21.08 v77.93,20.83
  Bottom 0.203: v77.93,20.83 79.4,21.13 v79.81,21.26
N$3
  Top 0.203: R2.1 80.97,7.62 arc-90 81.58,7.01 IC4.4
N$4
  Top 0.203: R1.1 80.87,12.7 82.7,10.87 82.7,10.21 XT1.A 82.75,9.35 85.09,9.35 C2.1 84.84,9.3 84.84,6.04 83.82,6.04 IC4.2
N$5
  Bottom 0.203: C4.1 46.13,46.99 46.77,47.64 arc45 47.65,49.75 47.65,52.12 U3.2
N$6
  Top 0.203: LED2.C 80.52,55.88 80.47,55.83 80.47,54.61 C57.1 80.47,54.56 80.47,52.07 R24.1
N$7  (via drill 0.3)
  other vias: 77.47,38.1
N$8
  Top 0.203: U$7.2 83.82,52.27 82.14,52.27 82.14,52.07 R24.2
N$9
  Bottom 0.203: C4.2 47.9,46.99 47.9,47.95 arc-45 48.12,48.48 arc45 48.36,49.06 48.36,52.12 U3.3
N$10
  Bottom 0.203: U3.4 49.1,47.03 arc90 C5.1
N$11
  Bottom 0.203: 50.8,47.13 arc90 C5.2 50.8,47.13 | U3.5 49.8,49.69 arc45 50.1,48.96 50.27,48.79 arc-45 50.8,47.52 50.8,47.13
N$12
  Top 0.254: U1.1 87.63,14.43 90.17,14.43 F1.1
N$13  (via drill 0.3)
  Top 0.203: v65.73,44.81 65.89,44.96 v65.89,54.51
  Bottom 0.203: v65.73,44.81 65.48,44.81 64.77,44.09 C8.1 | v65.89,54.51 65.68,54.3 65.58,54.3 65.23,53.95 65.23,52.17 U3.27
N$14
  Top 0.203: IC6.3 27.97,6.77 | 27.97,6.77 R10.2 | R9.1 27.97,6.77
N$15  (via drill 0.3)
  Top 0.203: R18.1 R19.2 | C17.1 35.56,15.7 33.07,15.7 R18.1 | v29.82,16.36 29.82,17.42 29.87,17.48 IC6.9 | v32,15.85 32.97,15.85 32.97,15.75 R18.1
  Bottom 0.203: v32,15.85 30.35,15.85 arc-45 29.88,16.05 v29.82,16.36
N$16  (via drill 0.3)
  Top 0.203: 30.02,6.91 30.02,9.1 arc45 29.31,10.82 29.31,11.43 IC6.5 | 30.02,6.91 30.02,5.13 30.48,4.67 C12.2 | v36.17,6.91 36.17,6.6 36.83,5.94 R12.2 | 30.02,6.91 v30.23,6.91
  Bottom 0.203: v30.23,6.91 v36.17,6.91
N$17
  Top 0.203: R13.2 32.21,3.81 32.21,6.35 C13.1 32.21,6.4 32.21,8.89 R14.1 30.9,10.16 30.48,10.16 29.92,10.72 IC6.6
N$18
  Top 0.203: R16.2 20.32,19.51 22.86,19.51 C16.1
N$19
  Top 0.203: C12.1 30.48,3 27.84,3 27.84,3.76 D11.3 27.74,3.81 22.05,3.81 | 22.05,3.81 22.05,5.08 R30.1 21.95,5.13 20.88,6.2 arc-45 20.37,7.42 20.37,7.98 R11.2 20.32,8.08 21.31,9.06 arc45 21.54,9.63 21.54,11.53 D1.3 | 22.05,3.81 22.05,2.54 C11.1
N$20
  Top 0.203: D2.1 10.67,19.96 8.89,19.96 C14.2 | 8.89,19.91 C14.2 | D3.3 7.09,19.9 C14.2
N$21
  Top 0.203: 16.51,21.18 17.78,21.18 R15.2 17.83,21.18 20.32,21.18 R16.1 | C15.1 15.24,21.18 16.51,21.18 | 20.37,21.23 R16.1 | D2.3 12.6,19 12.78,18.82 arc-45 13.21,17.78 13.21,13.31 13.36,13.16 16.05,13.16 16.05,14.68 17.88,16.51 D10.3 17.77,16.52 arc-90 16.51,17.78 16.51,21.18 | R41.1 22.86,23.27 22.43,23.27 20.45,21.29 R16.1
N$22  (via drill 0.3)
  Top 0.203: C16.2 22.86,21.18 25.4,21.18 R37.2 25.45,21.18 v26.92,21.18 | v26.92,21.18 27.94,21.18 R17.2 | v29.31,21.18 30.48,21.18 R36.2 | IC6.10 29.06,17.73 29.06,18.29 28.65,18.69 27.13,18.69 27.13,21.13 v26.92,21.18
  Bottom 0.203: v26.92,21.18 v29.31,21.18
N$23
  Top 0.203: R20.2 14.83,22.86 16.21,24.24 arc-45 18.03,24.99 IC5.1
N$24  (via drill 0.3)
  Top 0.203: R54.2 39.37,34.75 C18.1 39.42,34.75 41.91,34.75 R53.1 41.96,34.65 v43.89,32.72 | v53.39,32.56 53.39,31.34 53.59,31.14 IC8.23
  Bottom 0.203: v53.39,32.56 53.24,32.72 v43.89,32.72
N$25  (via drill 0.3)
  Top 0.203: v67.11,47.9 66.55,48.46 v66.55,49.73
  Bottom 0.203: v67.11,47.9 66.04,47.9 C6.1 | v66.55,49.73 65.94,50.34 65.94,52.12 U3.28
N$26
  Top 0.203: R21.2 18.64,22.86 18.87,23.08 arc45 19.36,24.26 19.36,24.99 IC5.3
N$27  (via drill 0.3)
  Top 0.203: v40.79,20.52 40.79,25.91 40.69,26.01 40.69,29.17 arc-45 41.08,30.11 41.45,30.48 R39.2 | v46.89,18.19 47.45,17.63 v47.45,16.46 | v52.12,16.46 52.48,16.82 52.48,21.49 52.53,21.54 U2.37
  Bottom 0.203: v52.12,16.46 v47.45,16.46 | v40.79,20.52 42.52,19.44 arc45 43.37,19.3 44.92,19.3 arc-61 45.73,18.82 arc61 46.8,18.19 v46.89,18.19
N$28  (via drill 0.3)
  Top 0.203: v64.92,48.11 65.33,48.51 v65.33,49.58
  Bottom 0.203: v64.92,48.11 63.75,48.11 63.5,47.85 R3.2 | v65.33,49.58 64.97,49.94 64.92,49.94 64.52,50.34 64.52,52.12 U3.26
N$30  (via drill 0.3)
  Top 0.203: D5.3 88.9,10.01 88.04,10.87 88.04,11.43 C9.2 87.93,11.48 arc45 87.43,12.7 86.56,13.56 arc90 86.16,13.97 D4.3 82.65,14.02 82.65,14.12 arc45 82.18,15.25 v81.84,15.6 | v77.16,15.6 77.16,18.49 arc45 76.91,19.1 IC2.1
  Bottom 0.203: v81.84,15.6 v77.16,15.6
N$31  (via drill 0.3)
  Top 0.203: R45.2 12.7,39.78 10.21,39.78 R29.2 10.16,39.83 7.62,39.83 R27.2 TP4.1 v7.62,33.83 | v6.5,28.9 6.5,26.7 arc90 6.89,26.31 7.98,26.31 SV2.3
  Bottom 0.203: v6.5,28.9 6.5,33.83 v7.62,33.83
N$32
  Top 0.203: R46.2 4.27,44.45 4.27,41.96 R28.2 4.27,41.91 4.27,39.37 R22.2 4.32,39.32 5.03,38.61 5.03,35.61 TP5.1 7.87,32.77 7.87,27.99 7.98,27.89 SV2.1
N$33  (via drill 0.3)
  Top 0.203: v9.14,41.5 7.62,41.5 R27.1 | 15.24,41.55 v15.19,41.5 15.19,42.84 arc-90 IC9.18 15.27,41.88 arc90 15.88,41.27 arc90 16.57,41.97 IC9.16 | 16.56,42.88 IC9.16 | IC9.16 16.57,41.85 arc90 17.14,41.27 arc90 17.87,42 IC9.14 17.87,41.82 arc90 18.41,41.27 arc90 19.17,42.03 IC9.12
  Bottom 0.203: v15.19,41.5 v9.14,41.5
N$34
  Top 0.203: R28.1 5.89,41.91 arc-45 5.13,43.75 5.13,49.43 arc-90 5.69,49.99 24.18,49.99 24.18,42.93 arc90 IC10.16 | IC10.16 | IC10.18 22.91,42.93 22.91,43.87 arc-90 23.49,44.45 arc-90 24.19,43.76 IC10.16 | 25.45,42.93 IC10.14 | IC10.16 24.19,43.88 arc-90 24.77,44.45 arc-90 25.49,43.73 IC10.14 | IC10.14 25.49,43.91 arc-90 26.03,44.45 arc-90 26.79,43.7 IC10.12
N$35
  Top 0.203: 17.78,10.57 18.69,9.65 D7.1 | 17.78,10.57 17.78,11.53 Q1.3 | RLY1.10 13.97,8.73 arc-90 15.75,10.52 17.73,10.52 17.78,10.57
N$36  (via drill 0.3)
  Top 0.203: IC12.9 7.56,9.41 arc90 8.08,9.93 arc-45 8.17,10.15 arc-45 8.68,10.36 9.65,10.36 | RLY1.9 11.43,8.83 arc90 9.89,10.36 9.65,10.36 | 9.65,16.92 arc45 9.29,17.78 8.89,18.19 C14.1 | 9.65,10.36 9.65,16.92 | v16.26,21.74 arc-45 16.58,22.52 16.92,22.86 R21.1 | 9.65,16.92 10.27,16.92 arc45 12.25,17.73 v12.55,18.03
  Bottom 0.203: v12.55,18.03 v16.26,21.74
N$37  (via drill 0.3)
  Top 0.203: RLY1.7 6.35,5.74 | v34.9,28.65 34.9,28.96 35.56,29.62 C42.1 | v26.57,21.95 26.57,27.58 arc45 v26.31,28.19 | v12.45,12.65 arc45 12.19,12.04 12.19,3.76 12.04,3.61 6.35,3.61 RLY1.7 | RLY1.7 6.35,6.35 arc-90 5.38,7.32 5.38,8.59 5.33,8.64 IC12.7
  Bottom 0.203: v34.9,28.65 34.44,28.19 v26.31,28.19 | v26.57,21.95 26.57,21.64 20.37,15.44 15.38,15.44 arc45 15.14,15.35 v12.45,12.65
N$38
  Top 0.203: R40.2 arc-90 20.71,14.78 20.68,14.78 arc45 19.63,14.35 18.74,13.46 Q1.1
N$39  (via drill 0.3)
  Top 0.203: v6.04,12.34 6.04,11.89 5.84,11.68 IC12.13 | v10.21,13.11 v11.43,14.33 RLY1.2 | v22.55,11.89 22.55,13.46 D1.1 22.53,11.94 22.35,11.94 | v12.75,20.02 12.75,22.5 13.11,22.86 R20.1
  Bottom 0.203: 7.37,13.11 7.3,13.11 arc56 6.14,12.48 v6.04,12.34 | 7.37,13.11 v10.21,13.11 arc108 11.43,11.43 22.1,11.43 arc90 v22.55,11.89 | v12.75,20.02 arc-45 12.43,19.23 7.69,14.5 arc45 7.37,13.71 7.37,13.11
N$40  (via drill 0.3)
  Top 0.203: v53.04,17.88 53.04,21.54 U2.36 | R44.2 41.45,27.94 41.35,27.84 41.35,18.29 v41.81,17.83
  Bottom 0.203: v41.81,17.83 42.62,17.02 52.17,17.02 v53.04,17.88
N$41  (via drill 0.3)
  Top 0.203: v6.5,35.66 6.5,38.81 5.94,39.37 R22.1 | IC9.5 16.57,38 | IC9.7 17.83,36.83 17.83,37.88 arc90 17.72,38 16.57,38 | IC9.3 15.27,38 v14.73,38 16.57,38
  Bottom 0.203: v6.5,35.66 8.84,38 v14.73,38
N$42  (via drill 0.3)